# EAGLE design Comparator_Board_New_eagle7x (EAGLE 7.7.0)
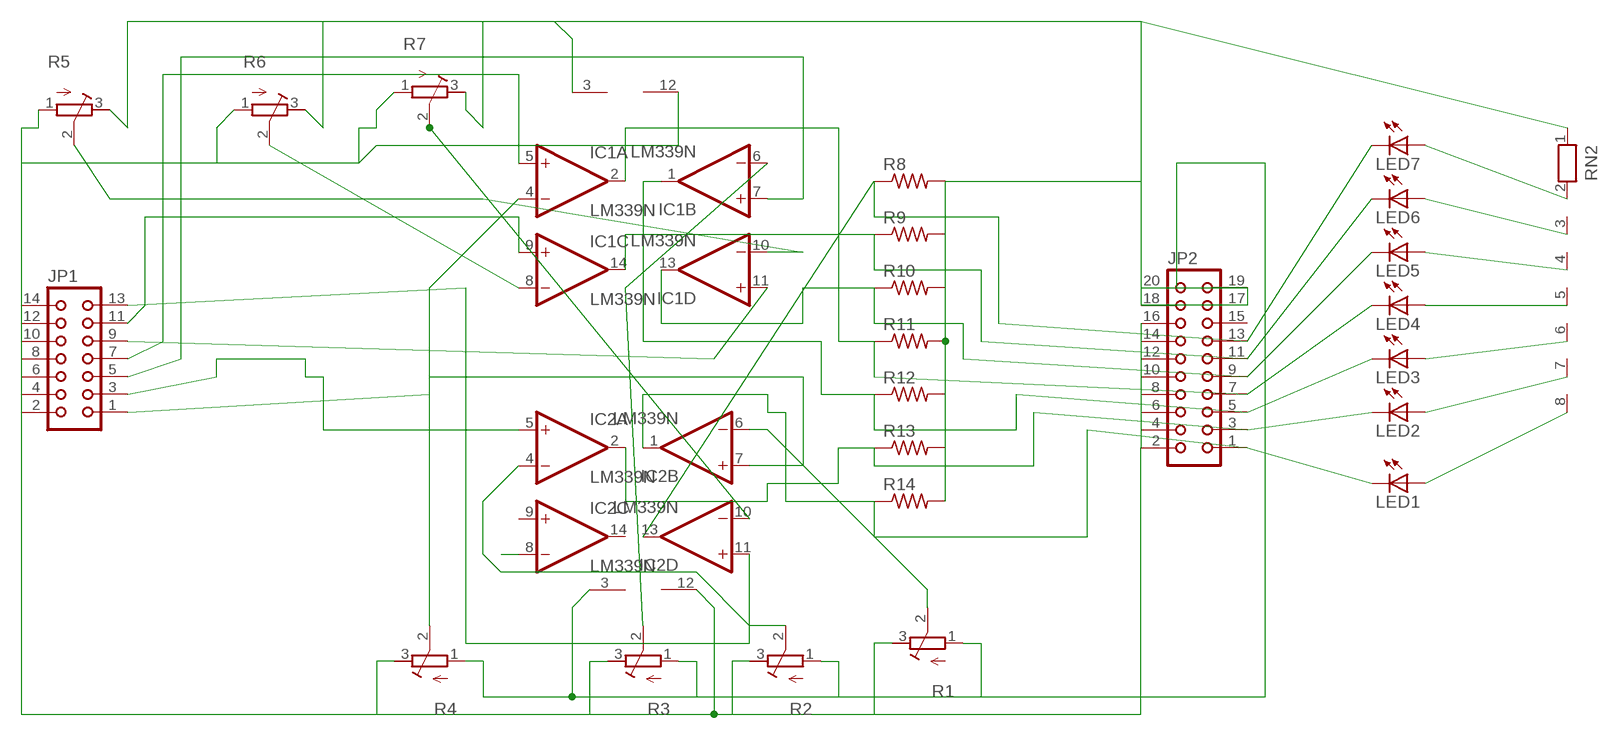
[diagram p0: schematic, sheet 1]

## Parts
IC1  LM339N  [DIL14]
IC2  LM339N  [DIL14]
JP1  CON14  [CON14]
JP2  CON20  [CON20]
LED1  LED3MM  [LED3MM]
LED2  LED3MM  [LED3MM]
LED3  LED3MM  [LED3MM]
LED4  LED3MM  [LED3MM]
LED5  LED3MM  [LED3MM]
LED6  LED3MM  [LED3MM]
LED7  LED3MM  [LED3MM]
R1  R-TRIMM3296W  [RTRIM3296W]
R2  R-TRIMM3296W  [RTRIM3296W]
R3  R-TRIMM3296W  [RTRIM3296W]
R4  R-TRIMM3296W  [RTRIM3296W]
R5  R-TRIMM3296W  [RTRIM3296W]
R6  R-TRIMM3296W  [RTRIM3296W]
R7  R-TRIMM3296W  [RTRIM3296W]
R8  R-US_0207/15  [0207/15]
R9  R-US_0207/15  [0207/15]
R10  R-US_0207/15  [0207/15]
R11  R-US_0207/15  [0207/15]
R12  R-US_0207/15  [0207/15]
R13  R-US_0207/15  [0207/15]
R14  R-US_0207/15  [0207/15]
RN2  RN07  [RN-8]

## Nets
N$1: IC2.7(B:+IN) JP1.1
N$2: IC1.7(B:+IN) JP1.5
N$3: IC1.5(A:+IN) JP1.7
N$4: IC1.11(D:+IN) JP1.9
N$5: IC1.9(C:+IN) JP1.11
N$6: IC2.13(D:OUT) JP2.13 LED7.K(C) R8.1
N$7: IC2.11(D:+IN) JP1.13
N$8: IC2.5(A:+IN) JP1.3
N$9: IC1.14(C:OUT) JP2.11 LED6.K(C) R9.1
N$11: IC2.1(B:OUT) JP2.1 LED1.K(C) R14.1
N$12: IC2.2(A:OUT) JP2.3 LED2.K(C) R13.1
N$13: LED7.A RN2.2
N$14: IC1.12(P:GND) IC2.12(P:GND) JP1.2 JP1.4 JP1.6 JP1.8 JP1.10 JP1.12 JP1.14 JP2.2 JP2.4 JP2.6 JP2.8 JP2.10 JP2.12 JP2.14 JP2.16 R1.3(A) R2.3(A) R3.3(A) R4.3(A) R5.1(E) R6.1(E) R7.1(E)
N$16: IC2.8(C:-IN)
N$17: LED6.A RN2.3
N$18: LED5.A RN2.4
N$19: IC1.1(B:OUT) JP2.5 LED3.K(C) R12.1
N$20: IC1.2(A:OUT) JP2.7 LED4.K(C) R11.1
N$21: IC1.13(D:OUT) JP2.9 LED5.K(C) R10.1
N$22: LED4.A RN2.5
N$23: LED3.A RN2.6
N$24: LED2.A RN2.7
N$25: LED1.A RN2.8
N$26: IC2.6(B:-IN) R1.2(S)
N$27: IC2.4(A:-IN) R2.2(S)
N$28: IC1.6(B:-IN) R3.2(S)
N$29: IC1.4(A:-IN) R4.2(S)
N$30: IC1.10(D:-IN) R5.2(S)
N$31: IC1.8(C:-IN) R6.2(S)
N$32: IC2.10(D:-IN) R7.2(S)
N$33: IC1.3(P:V+) IC2.3(P:V+) JP2.17 JP2.18 JP2.19 JP2.20 R1.1(E) R2.1(E) R3.1(E) R4.1(E) R5.3(A) R6.3(A) R7.3(A) R8.2 R9.2 R10.2 R11.2 R12.2 R13.2 R14.2 RN2.1
Unconnected: IC2.9(C:+IN) IC2.14(C:OUT) JP2.15

## Library data of the parts
IC1 IC2 = linear:LM339: Low Power Low Offset Voltage Quad Comparators with open collector; LM139/LM239/LM339/LM2901/LM3302
JP1 = con-harting:CON14: CONNECTOR
JP2 = con-harting:CON20: CONNECTOR
LED1-LED7 = led:LED: LED OSRAM: - CHIPLED LG R971, LG N971, LY N971, LG Q971, LY Q971, LO R971, LY R971 LH N974, LH R974 LS Q976, LO Q976, LY Q976 LO Q996 - Hyper CHIPLED LW Q18S LB Q993, LB Q99A, LB R99A - SideLED LS A670, LO A670, LY A670, LG A670, LP A670 LB A673, LV A673, LT A673, LW A673 LH A674 LY A675 LS A676, LA A676, LO A676, LY A676, LW A676 LS A679, LY A679, LG A679 - Hyper Micro SIDELED® LS Y876, LA Y876, LO Y876, LY Y876 LT Y87S - SmartLED LW L88C, LW L88S LB L89C, LB L89S, LG L890 LS L89K, LO L89K, LY L89K LS L896, LA L896, LO L896, LY L896 - TOPLED LS T670, LO T670, LY T670, LG T670, LP T670 LSG T670, LSP T670, LSY T670, LOP T670, LYG T670 LG T671, LOG T671, LSG T671 LB T673, LV T673, LT T673, LW T673 LH T674 LS T676, LA T676, LO T676, LY T676, LB T676, LH T676, LSB T676, LW T676 LB T67C, LV T67C, LT T67C, LS T67K, LO T67K, LY T67K, LW E67C LS E67B, LA E67B, LO E67B, LY E67B, LB E67C, LV E67C, LT E67C LW T67C LS T679, LY T679, LG T679 LS T770, LO T770, LY T770, LG T770, LP T770 LB T773, LV T773, LT T773, LW T773 LH T774 LS E675, LA E675, LY E675, LS T675 LS T776, LA T776, LO T776, LY T776, LB T776 LHGB T686 LT T68C, LB T68C - Hyper Mini TOPLED® LB M676 - Mini TOPLED Santana® LG M470 LS M47K, LO M47K, LY M47K Source: http://www.osram.convergy.de LUXEON: - LUMILED® LXK2-PW12-R00, LXK2-PW12-S00, LXK2-PW14-U00, LXK2-PW14-V00 LXK2-PM12-R00, LXK2-PM12-S00, LXK2-PM14-U00 LXK2-PE12-Q00, LXK2-PE12-R00, LXK2-PE12-S00, LXK2-PE14-T00, LXK2-PE14-U00 LXK2-PB12-K00, LXK2-PB12-L00, LXK2-PB12-M00, LXK2-PB14-N00, LXK2-PB14-P00, LXK2-PB14-Q00 LXK2-PR12-L00, LXK2-PR12-M00, LXK2-PR14-Q00, LXK2-PR14-R00 LXK2-PD12-Q00, LXK2-PD12-R00, LXK2-PD12-S00 LXK2-PH12-R00, LXK2-PH12-S00 LXK2-PL12-P00, LXK2-PL12-Q00, LXK2-PL12-R00 Source: www.luxeon.com KINGBRIGHT: KA-3528ASYC Source: www.kingbright.com
R1-R7 = rcl:R-TRIMM: Trimm resistor
R8-R14 = rcl:R-US_: RESISTOR, American symbol
RN2 = resistor-net:RN07: RESISTOR NETWORK

## Board
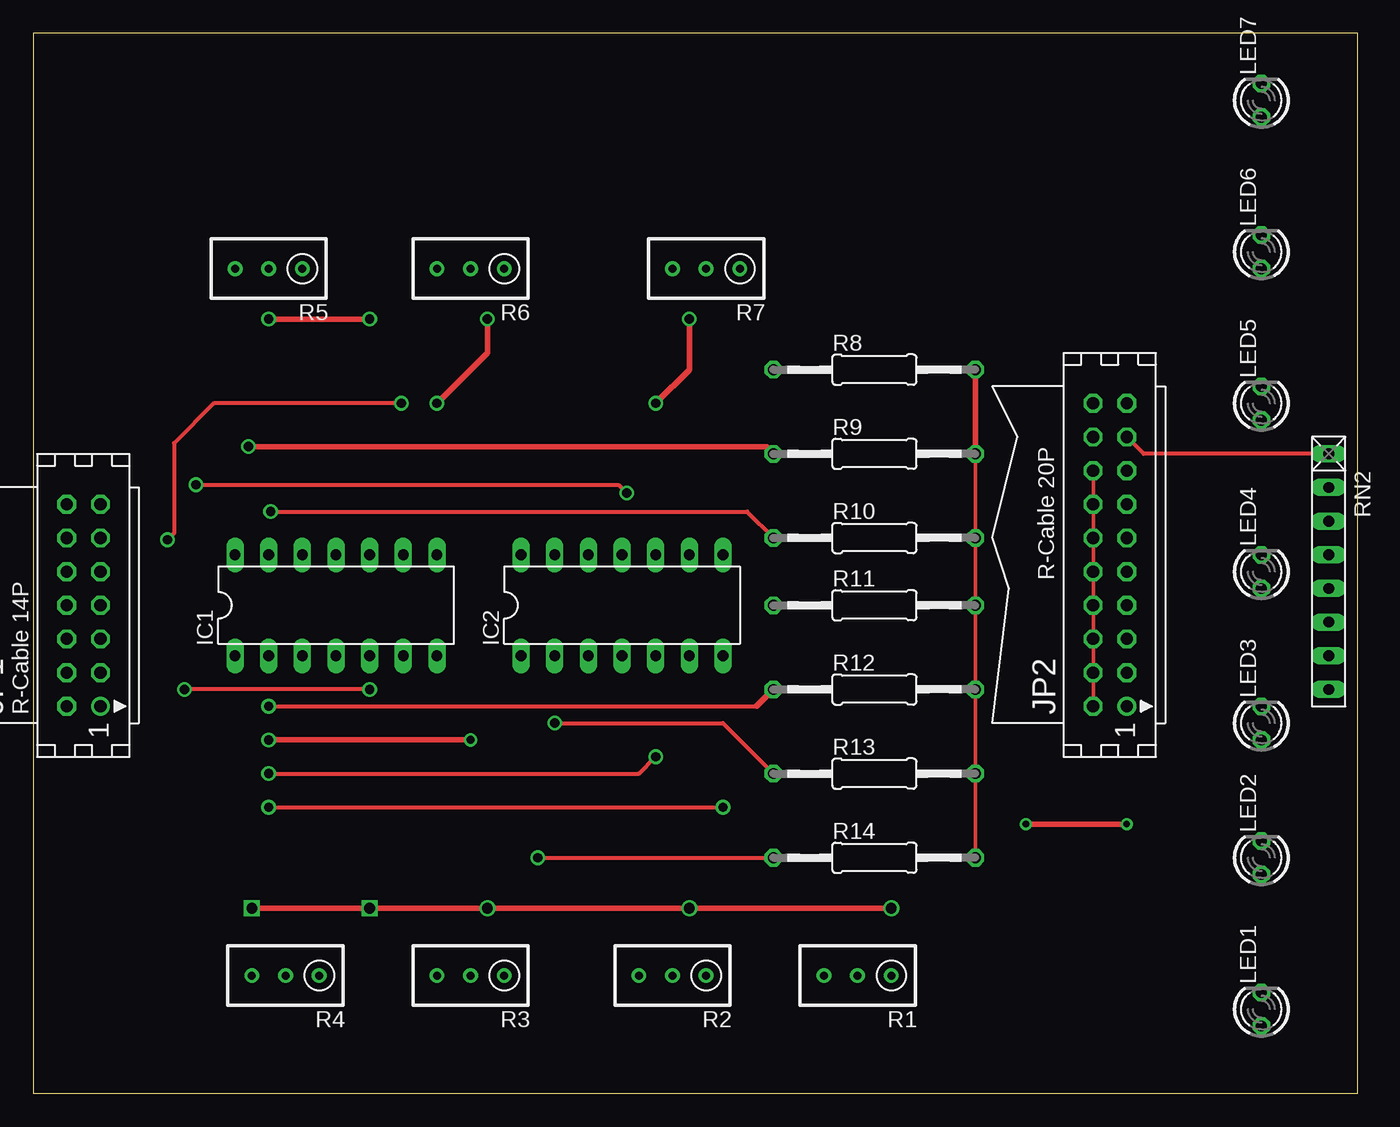
[diagram p1: board, top side]
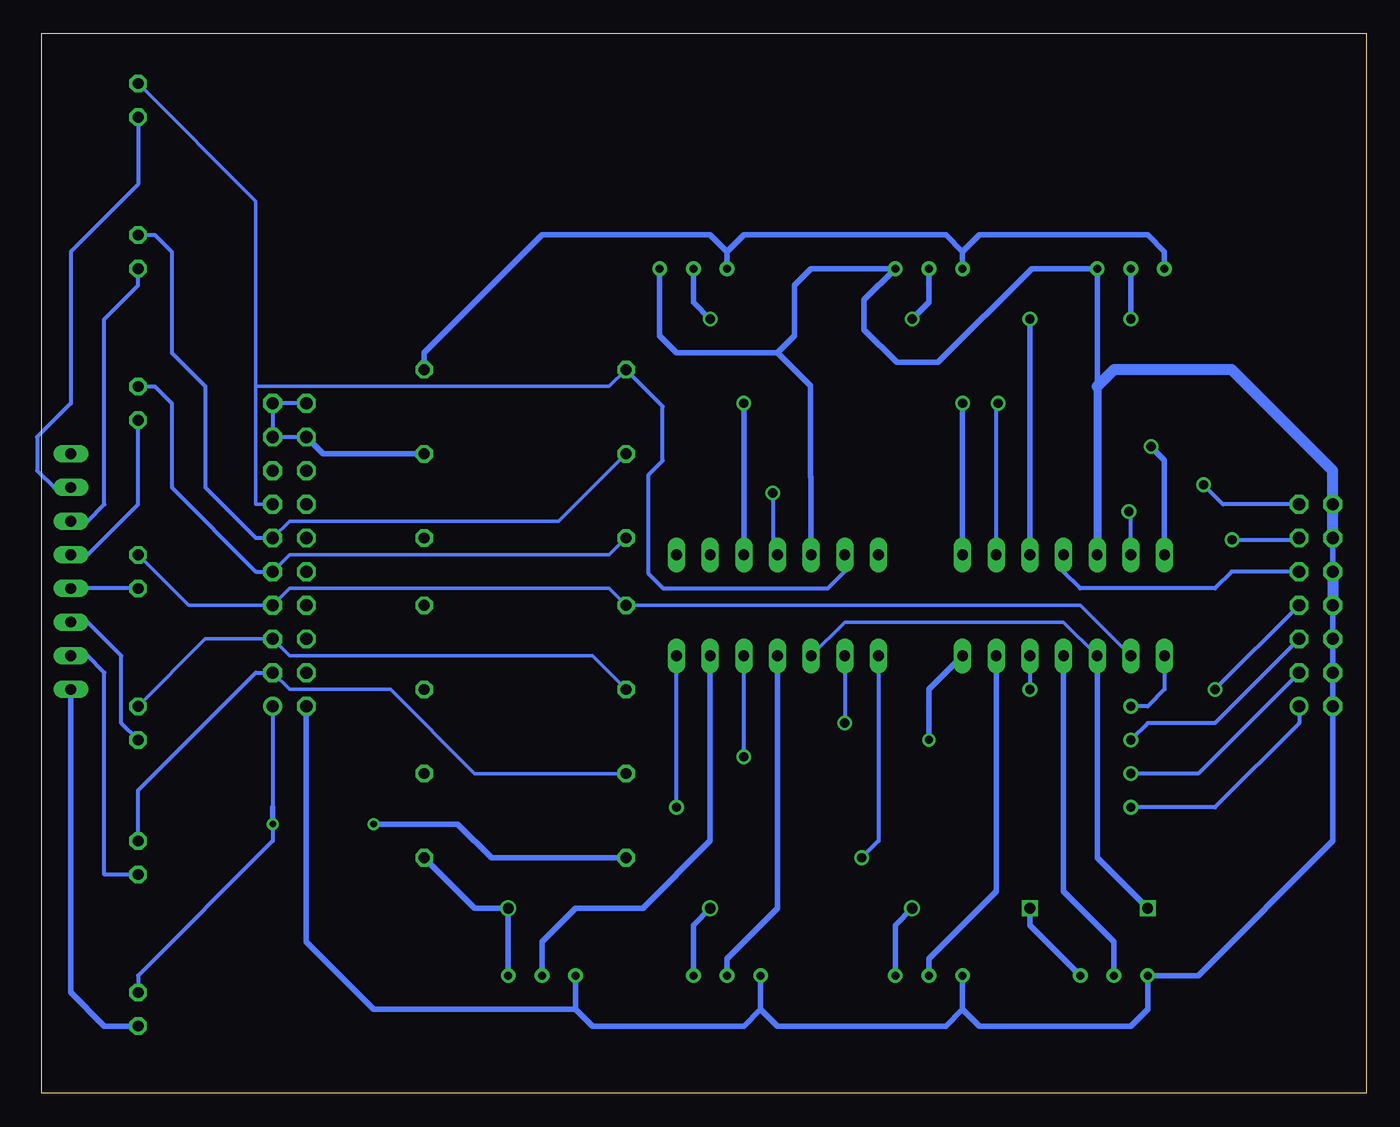
[diagram p2: board, bottom side, seen from below]

Size 100 x 80 mm. Coordinates in mm from the lower left corner, seen from the top.
Outline: 0,0 100,0 100,80 0,80 0,0
Copper layers (1*16): Top 0.035mm / dielectric 1.5mm / Bottom 0.035mm
Design rules "default": minimum track width 10mil, minimum drill 24mil, track to track 8mil, track to pad 8mil, pad to pad 8mil, via to via 8mil, smd to smd 8mil, copper to edge 40mil, drill to drill 8mil, minimum pad ring 10mil, minimum via ring 8mil, stop-mask expansion 4mil, vias tented up to drill 0mil, thermal gap 10mil

### Footprints (pad centres in the part's own frame; a part is rotated, then mirrored left to right if it is on the bottom)
DIL14 = drill 0.813 long: 1 -7.62,-3.81; 2 -5.08,-3.81; 3 -2.54,-3.81; 4 0,-3.81; 5 2.54,-3.81; 6 5.08,-3.81; 7 7.62,-3.81; 8 7.62,3.81; 9 5.08,3.81; 10 2.54,3.81; 11 0,3.81; 12 -2.54,3.81; 13 -5.08,3.81; 14 -7.62,3.81
CON14 = drill 0.914: 1 -7.62,-1.27 | drill 0.914 octagon: 2 -7.62,1.27; 3 -5.08,-1.27; 4 -5.08,1.27; 5 -2.54,-1.27; 6 -2.54,1.27; 7 0,-1.27; 8 0,1.27; 9 2.54,-1.27; 10 2.54,1.27; 11 5.08,-1.27; 12 5.08,1.27; 13 7.62,-1.27; 14 7.62,1.27
CON20 = drill 0.914: 1 -11.43,-1.27 | drill 0.914 octagon: 2 -11.43,1.27; 3 -8.89,-1.27; 4 -8.89,1.27; 5 -6.35,-1.27; 6 -6.35,1.27; 7 -3.81,-1.27; 8 -3.81,1.27; 9 -1.27,-1.27; 10 -1.27,1.27; 11 1.27,-1.27; 12 1.27,1.27; 13 3.81,-1.27; 14 3.81,1.27; 15 6.35,-1.27; 16 6.35,1.27; 17 8.89,-1.27; 18 8.89,1.27; 19 11.43,-1.27; 20 11.43,1.27
LED3MM = drill 0.813 octagon: A -1.27,0; K 1.27,0
RTRIM3296W = drill 0.61: 1 0,-2.54; 2 0,0; 3 0,2.54
0207/15 = drill 0.813 octagon: 1 -7.62,0; 2 7.62,0
RN-8 = drill 0.813 long: 1 -8.89,0; 2 -6.35,0; 3 -3.81,0; 4 -1.27,0; 5 1.27,0; 6 3.81,0; 7 6.35,0; 8 8.89,0

### Placement (x,y rotation side)
IC1  22.86,36.83 0 top
IC2  44.45,36.83 0 top
JP1  3.81,36.83 90 top
JP2  81.28,40.64 90 top
LED1  92.71,6.35 90 top
LED2  92.71,17.78 90 top
LED3  92.71,27.94 90 top
LED4  92.71,39.37 90 top
LED5  92.71,52.07 90 top
LED6  92.71,63.5 90 top
LED7  92.71,74.93 90 top
R1  62.23,8.89 90 top
R2  48.26,8.89 90 top
R3  33.02,8.89 90 top
R4  19.05,8.89 90 top
R5  17.78,62.23 90 top
R6  33.02,62.23 90 top
R7  50.8,62.23 90 top
R8  63.5,54.61 0 top
R9  63.5,48.26 0 top
R10  63.5,41.91 0 top
R11  63.5,36.83 0 top
R12  63.5,30.48 0 top
R13  63.5,24.13 0 top
R14  63.5,17.78 0 top
RN2  97.79,39.37 270 top

### Tracks (layer width: path | path; a pad name or v marks a point on that pad's centre or on a via)
N$1  (via drill 0.7)
  Top 0.305: v17.78,21.59 v52.07,21.59
  Bottom 0.305: JP1.1 5.08,27.94 11.43,21.59 v17.78,21.59 | v52.07,21.59 IC2.7
N$2  (via drill 0.61, 0.7)
  Top 0.406: v17.78,26.67 v33.02,26.67
  Bottom 0.305: JP1.5 11.43,27.94 16.51,27.94 v17.78,26.67
  Bottom 0.406: v33.02,26.67 33.02,30.48 IC1.7
N$3  (via drill 0.7)
  Top 0.305: v25.4,30.48 v11.43,30.48
  Bottom 0.305: IC1.5 v25.4,30.48 | v11.43,30.48 JP1.7
N$4
  Bottom 0.305: JP1.9 10.16,39.37 11.43,38.1 21.59,38.1 22.86,39.37 IC1.11
N$5  (via drill 0.7)
  Top 0.305: v27.8,52.07 13.63,52.07 10.63,49.07 10.63,42.27 v10.13,41.77
  Bottom 0.305: IC1.9 27.94,51.93 v27.8,52.07 | v10.13,41.77 5.22,41.77 JP1.11
N$6
  Bottom 0.254: LED7.K 83.82,67.31 83.82,53.34 | 83.82,53.34 83.82,44.45 JP2.13 | R8.1 57.15,53.34 83.82,53.34
  Bottom 0.305: IC2.13 39.37,39.4 40.68,38.09 53.07,38.09 54.17,39.2 54.17,46.69 53.12,47.75 53.12,51.85 R8.1
N$7  (via drill 0.7)
  Top 0.305: v12.29,45.92 44.18,45.92 v44.81,45.3
  Bottom 0.305: JP1.13 10.82,44.45 v12.29,45.92 | v44.81,45.3 44.81,41 IC2.11
N$8  (via drill 0.7)
  Top 0.305: v17.78,24.13 45.72,24.13 v46.99,25.4
  Bottom 0.305: JP1.3 12.7,24.13 v17.78,24.13 | v46.99,25.4 IC2.5
N$9  (via drill 0.7)
  Top 0.406: v16.25,48.8 55.34,48.8 R9.1
  Bottom 0.254: JP2.11 81.28,43.18 60.96,43.18 R9.1
  Bottom 0.305: LED6.K 91.44,64.77 90.17,63.5 90.17,55.88 87.63,53.34 87.63,45.72 83.82,41.91 JP2.11
  Bottom 0.406: IC1.14 15.24,47.79 v16.25,48.8
N$11  (via drill 0.5, 0.7)
  Top 0.305: v38.1,17.78 R14.1
  Top 0.406: v74.93,20.32 v82.55,20.32
  Bottom 0.305: JP2.1 82.55,21.59 | v82.55,20.32 82.55,19.05 92.71,8.89 LED1.K | IC2.1 36.83,19.05 v38.1,17.78
  Bottom 0.406: R14.1 66.04,17.78 68.58,20.32 v74.93,20.32 | v82.55,20.32 82.55,21.59
N$12  (via drill 0.7)
  Top 0.305: v39.37,27.94 52.07,27.94 R13.1
  Bottom 0.254: JP2.3 81.28,30.48 73.66,30.48 67.31,24.13 R13.1
  Bottom 0.305: LED2.K 92.71,22.86 83.82,31.75 JP2.3 | IC2.2 v39.37,27.94
N$13
  Bottom 0.305: LED7.A 92.71,68.58 97.79,63.5 97.79,52.07 100.33,49.53 100.33,46.99 99.06,45.72 RN2.2
N$14
  Top 0.254: JP2.16 JP2.14 JP2.12 JP2.10 JP2.8 JP2.6 JP2.4 JP2.2
  Bottom 0.406: JP1.14 JP1.12 JP1.10 | JP1.8 JP1.6 JP1.4 JP1.2 2.54,19.05 12.7,8.89 R4.3 16.51,6.35 17.78,5.08 29.21,5.08 30.48,6.35 | R3.3 30.48,6.35 | 30.48,6.35 31.75,5.08 44.45,5.08 45.72,6.35 | R2.3 45.72,6.35 | 45.72,6.35 46.99,5.08 58.42,5.08 59.69,6.35 | 59.69,6.35 R1.3 | JP2.2 80.01,11.43 74.93,6.35 59.69,6.35 | 20.32,53.34 R5.1 25.25,62.23 32.32,55.16 35.43,55.16 37.91,57.64 37.91,59.88 R6.1 41.91,62.23 43.18,60.96 43.18,57.15 44.45,55.88 | 44.45,55.88 52.07,55.88 53.34,57.15 R7.1 | IC2.12 41.91,46.48 41.97,46.54 41.97,53.4 44.45,55.88
  Bottom 0.61: 20.32,53.34 IC1.12
  Bottom 0.813: JP1.12 2.54,46.99 10.16,54.61 19.05,54.61 20.32,53.34 | JP1.10 JP1.8
N$17
  Bottom 0.305: RN2.3 96.52,43.18 95.25,44.45 95.25,58.42 92.71,60.96 LED6.A
N$18
  Bottom 0.305: RN2.4 96.52,40.64 92.71,44.45 LED5.A
N$19  (via drill 0.7)
  Top 0.305: v17.78,29.21 54.61,29.21
  Top 0.406: 54.61,29.21 R12.1
  Bottom 0.254: LED3.K 87.63,34.29 JP2.5 81.28,33.02 58.42,33.02 R12.1
  Bottom 0.305: IC1.1 15.24,30.48 16.51,29.21 v17.78,29.21
N$20
  Bottom 0.254: LED4.K 88.9,36.83 JP2.7 81.28,38.1 57.15,38.1 R11.1 21.59,36.83 IC1.2
N$21  (via drill 0.7)
  Top 0.305: v17.92,43.9 53.89,43.9 R10.1
  Bottom 0.254: JP2.9 81.28,40.64 57.15,40.64 R10.1
  Bottom 0.305: LED5.K 91.44,53.34 90.17,52.07 90.17,45.72 83.82,39.37 JP2.9 | IC1.13 17.78,43.75 v17.92,43.9
N$22
  Bottom 0.305: LED4.A RN2.5
N$23
  Bottom 0.305: LED3.A 93.98,27.94 93.98,33.02 96.52,35.56 RN2.6
N$24
  Bottom 0.305: LED2.A 95.25,16.51 95.25,31.75 96.52,33.02 RN2.7
N$25
  Bottom 0.406: RN2.8 97.79,7.62 95.25,5.08 LED1.A
N$26
  Bottom 0.406: IC2.6 49.53,19.05 54.61,13.97 59.69,13.97 62.23,11.43 R1.2
N$27
  Bottom 0.406: IC2.4 44.45,13.97 48.26,10.16 R2.2
N$28
  Bottom 0.406: IC1.6 27.94,15.24 33.02,10.16 R3.2
N$29
  Bottom 0.406: IC1.4 22.86,15.24 19.05,11.43 R4.2
N$30  (via drill 0.7)
  Top 0.406: v25.4,58.42 v17.78,58.42
  Bottom 0.406: IC1.10 v25.4,58.42 | v17.78,58.42 R5.2
N$31  (via drill 0.7)
  Top 0.406: v34.29,58.42 34.29,55.88 v30.48,52.07
  Bottom 0.406: R6.2 33.02,59.69 v34.29,58.42 | v30.48,52.07 IC1.8
N$32  (via drill 0.7)
  Top 0.406: v49.53,58.42 49.53,54.61 v46.99,52.07
  Bottom 0.406: R7.2 50.8,59.69 v49.53,58.42 | v46.99,52.07 IC2.10
N$33  (via drill 0.8)
  Top 0.254: R14.2 R13.2 R12.2 R11.2 R10.2 R9.2
  Top 0.305: RN2.1 83.82,48.26 JP2.17
  Top 0.406: v16.51,13.97 v25.4,13.97 v34.29,13.97 v49.53,13.97 v64.77,13.97 | R8.2 R9.2
  Bottom 0.254: IC1.3 22.86,35.56 39.37,35.56 IC2.3
  Bottom 0.305: JP2.20 JP2.19 JP2.17 JP2.18
  Bottom 0.406: IC1.3 20.32,17.78 v16.51,13.97 | v25.4,13.97 25.4,12.7 R4.1 | R3.1 35.56,12.7 v34.29,13.97 | R2.1 50.8,12.7 v49.53,13.97 | R1.1 v64.77,13.97 67.31,13.97 R14.2 | R9.2 78.74,48.26 JP2.18 | R5.3 15.24,63.5 16.51,64.77 29.21,64.77 30.48,63.5 | 30.48,63.5 R6.3 | 48.26,63.5 46.99,64.77 31.75,64.77 30.48,63.5 | R7.3 48.26,63.5 | 48.26,63.5 49.53,64.77 62.23,64.77 71.12,55.88 R8.2